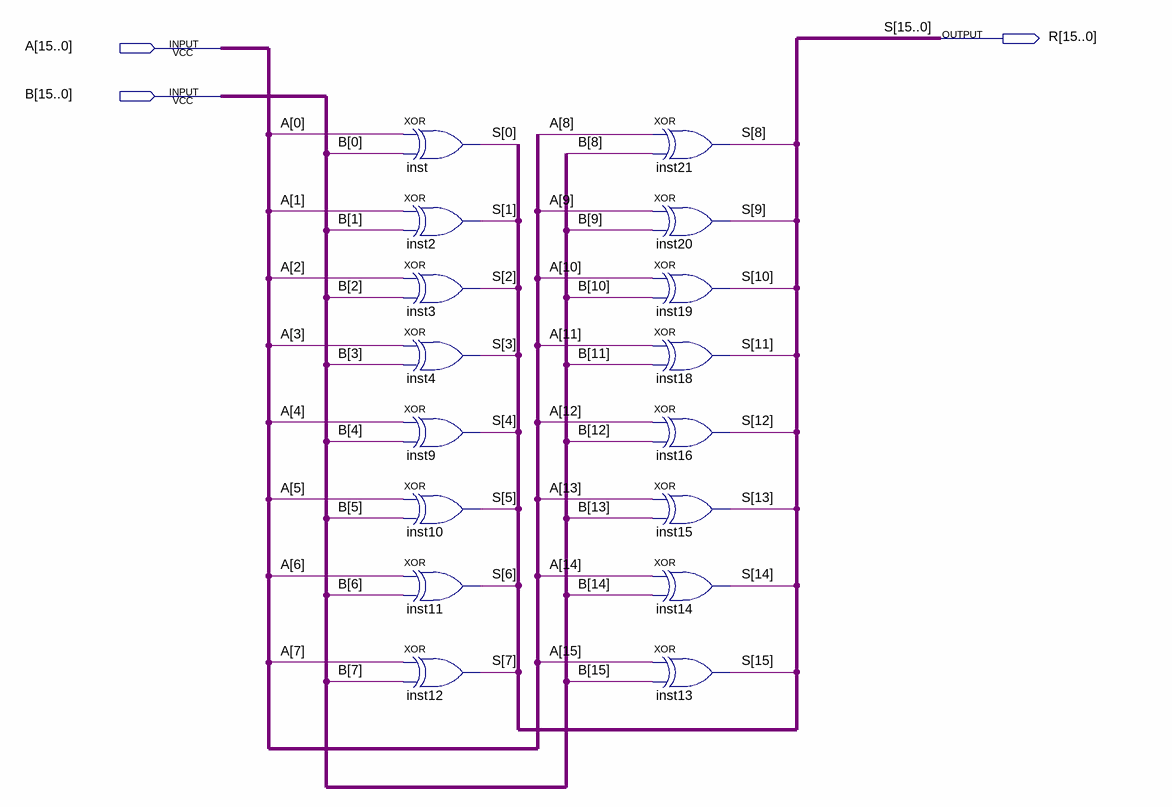
[diagram p0: schematic sheet]
// Quartus schematic XOR16BIT.bdf as structural Verilog: 16 symbols, 3 pins
module XOR16BIT (
  input  [15:0] A,
  input  [15:0] B,
  output [15:0] R
);

  xor inst (R[0], A[0], B[0]);
  xor inst2 (R[1], A[1], B[1]);
  xor inst3 (R[2], A[2], B[2]);
  xor inst4 (R[3], A[3], B[3]);
  xor inst9 (R[4], A[4], B[4]);
  xor inst10 (R[5], A[5], B[5]);
  xor inst11 (R[6], A[6], B[6]);
  xor inst12 (R[7], A[7], B[7]);
  xor inst21 (R[8], A[8], B[8]);
  xor inst20 (R[9], A[9], B[9]);
  xor inst19 (R[10], A[10], B[10]);
  xor inst18 (R[11], A[11], B[11]);
  xor inst16 (R[12], A[12], B[12]);
  xor inst15 (R[13], A[13], B[13]);
  xor inst14 (R[14], A[14], B[14]);
  xor inst13 (R[15], A[15], B[15]);

  // Other names for the same wires on the sheet: S[15:0] = R
endmodule
